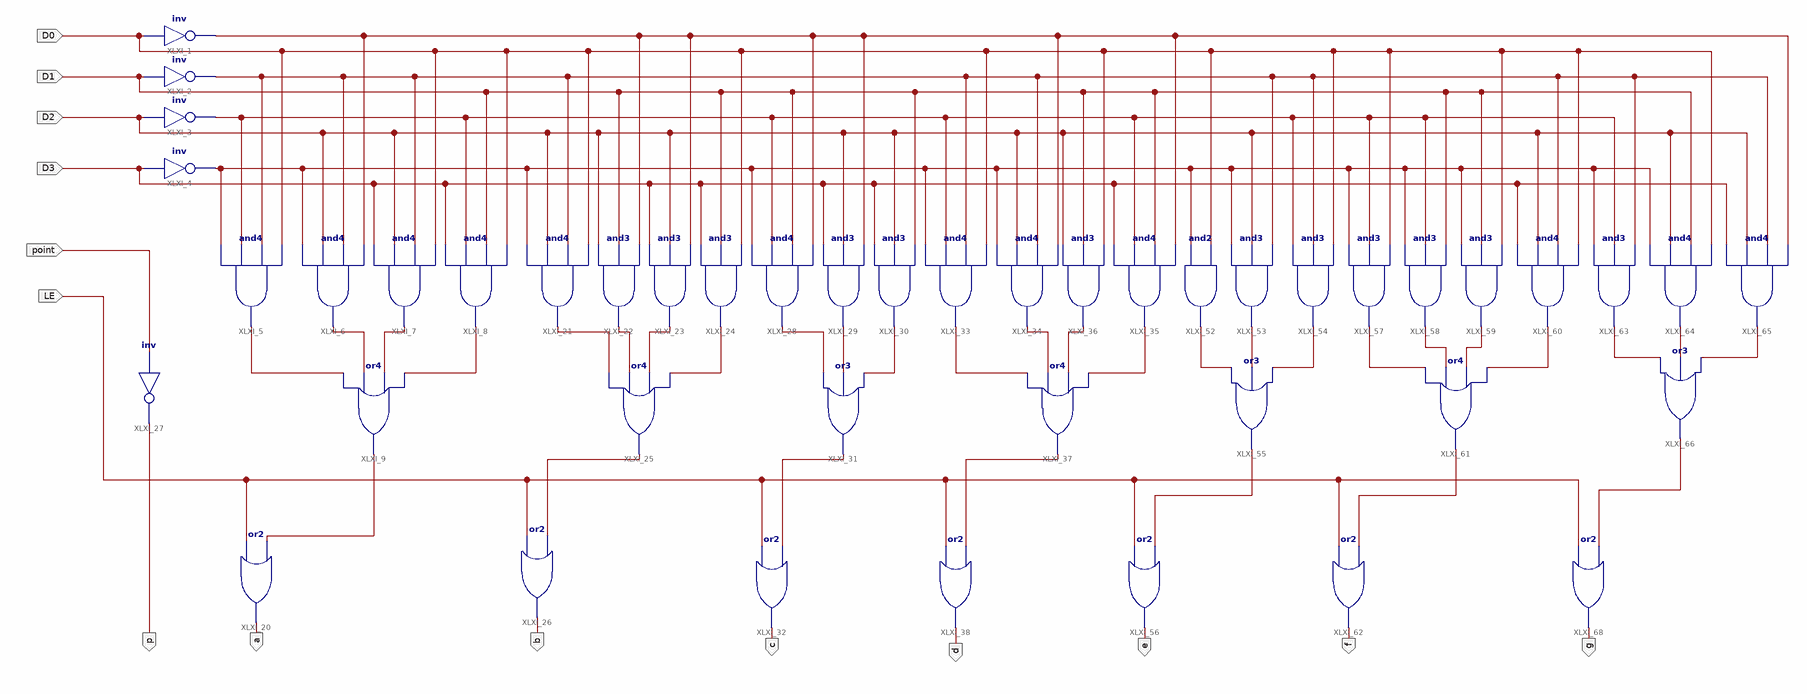
[diagram p0: schematic sheet 1]
// Xilinx ISE schematic MC14495.sch (kintex7) as structural Verilog: 44 symbols, 14 ports
module MC14495 (
  input  D0,
  input  D2,
  input  D1,
  input  point,
  input  LE,
  input  D3,
  output a,
  output b,
  output p,
  output c,
  output d,
  output e,
  output f,
  output g
);

  wire XLXN_7, XLXN_8, XLXN_9, XLXN_10, XLXN_11, XLXN_16, XLXN_17, XLXN_40, XLXN_42, XLXN_43, XLXN_44,
       XLXN_45, XLXN_46, XLXN_64, XLXN_65, XLXN_66, XLXN_68, XLXN_80, XLXN_81, XLXN_82, XLXN_83, XLXN_85,
       XLXN_211, XLXN_213, XLXN_214, XLXN_215, XLXN_224, XLXN_225, XLXN_226, XLXN_227, XLXN_229, XLXN_244,
       XLXN_245, XLXN_246, XLXN_249, XLXN_264;

  and XLXI_5 (XLXN_7, XLXN_11, XLXN_16, XLXN_17, D0);
  and XLXI_6 (XLXN_8, XLXN_11, D2, XLXN_17, XLXN_264);
  and XLXI_7 (XLXN_9, D3, D2, XLXN_17, D0);
  and XLXI_8 (XLXN_10, D3, XLXN_16, D1, D0);
  or XLXI_9 (XLXN_40, XLXN_7, XLXN_8, XLXN_9, XLXN_10);
  not XLXI_4 (XLXN_11, D3);
  not XLXI_3 (XLXN_16, D2);
  not XLXI_2 (XLXN_17, D1);
  or XLXI_20 (a, LE, XLXN_40);
  or XLXI_26 (b, LE, XLXN_46);
  not XLXI_27 (p, point);
  or XLXI_31 (XLXN_68, XLXN_64, XLXN_65, XLXN_66);
  and XLXI_33 (XLXN_80, XLXN_11, XLXN_16, XLXN_17, D0);
  and XLXI_34 (XLXN_81, XLXN_11, D2, XLXN_17, XLXN_264);
  and XLXI_35 (XLXN_83, D3, XLXN_16, D1, XLXN_264);
  and XLXI_36 (XLXN_82, D2, D1, D0);
  or XLXI_37 (XLXN_85, XLXN_80, XLXN_81, XLXN_82, XLXN_83);
  or XLXI_38 (d, LE, XLXN_85);
  or XLXI_25 (XLXN_46, XLXN_42, XLXN_43, XLXN_44, XLXN_45);
  and XLXI_21 (XLXN_42, XLXN_11, D2, XLXN_17, D0);
  and XLXI_22 (XLXN_43, D2, D1, XLXN_264);
  and XLXI_23 (XLXN_44, D3, D2, XLXN_264);
  and XLXI_24 (XLXN_45, D3, D1, D0);
  and XLXI_28 (XLXN_64, XLXN_11, XLXN_16, D1, XLXN_264);
  and XLXI_29 (XLXN_65, D3, D2, XLXN_264);
  and XLXI_30 (XLXN_66, D3, D2, D1);
  or XLXI_32 (c, LE, XLXN_68);
  and XLXI_52 (XLXN_213, XLXN_11, D0);
  and XLXI_53 (XLXN_214, XLXN_11, D2, XLXN_17);
  and XLXI_54 (XLXN_215, XLXN_16, XLXN_17, D0);
  or XLXI_55 (XLXN_211, XLXN_213, XLXN_214, XLXN_215);
  or XLXI_56 (e, LE, XLXN_211);
  and XLXI_57 (XLXN_224, XLXN_11, XLXN_16, D0);
  and XLXI_58 (XLXN_225, XLXN_11, XLXN_16, D1);
  and XLXI_59 (XLXN_226, XLXN_11, D1, D0);
  and XLXI_60 (XLXN_227, D3, D2, XLXN_17, D0);
  or XLXI_61 (XLXN_229, XLXN_224, XLXN_225, XLXN_226, XLXN_227);
  or XLXI_62 (f, LE, XLXN_229);
  and XLXI_63 (XLXN_244, XLXN_11, XLXN_16, XLXN_17);
  and XLXI_64 (XLXN_245, XLXN_11, D2, D1, D0);
  and XLXI_65 (XLXN_246, D3, D2, XLXN_17, XLXN_264);
  or XLXI_66 (XLXN_249, XLXN_244, XLXN_245, XLXN_246);
  or XLXI_68 (g, LE, XLXN_249);
  not XLXI_1 (XLXN_264, D0);
endmodule
